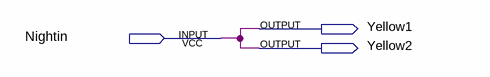
[diagram p0: schematic sheet]
// Quartus schematic DECFarolNight.bdf as structural Verilog: 0 symbols, 3 pins
module DECFarolNight (
  input  Nightin,
  output Yellow1,
  output Yellow2
);


  assign Yellow1 = Nightin;
  assign Yellow2 = Nightin;
endmodule
